# Altium schematic sheet 5G智慧网关工装1.SchDoc
size A3
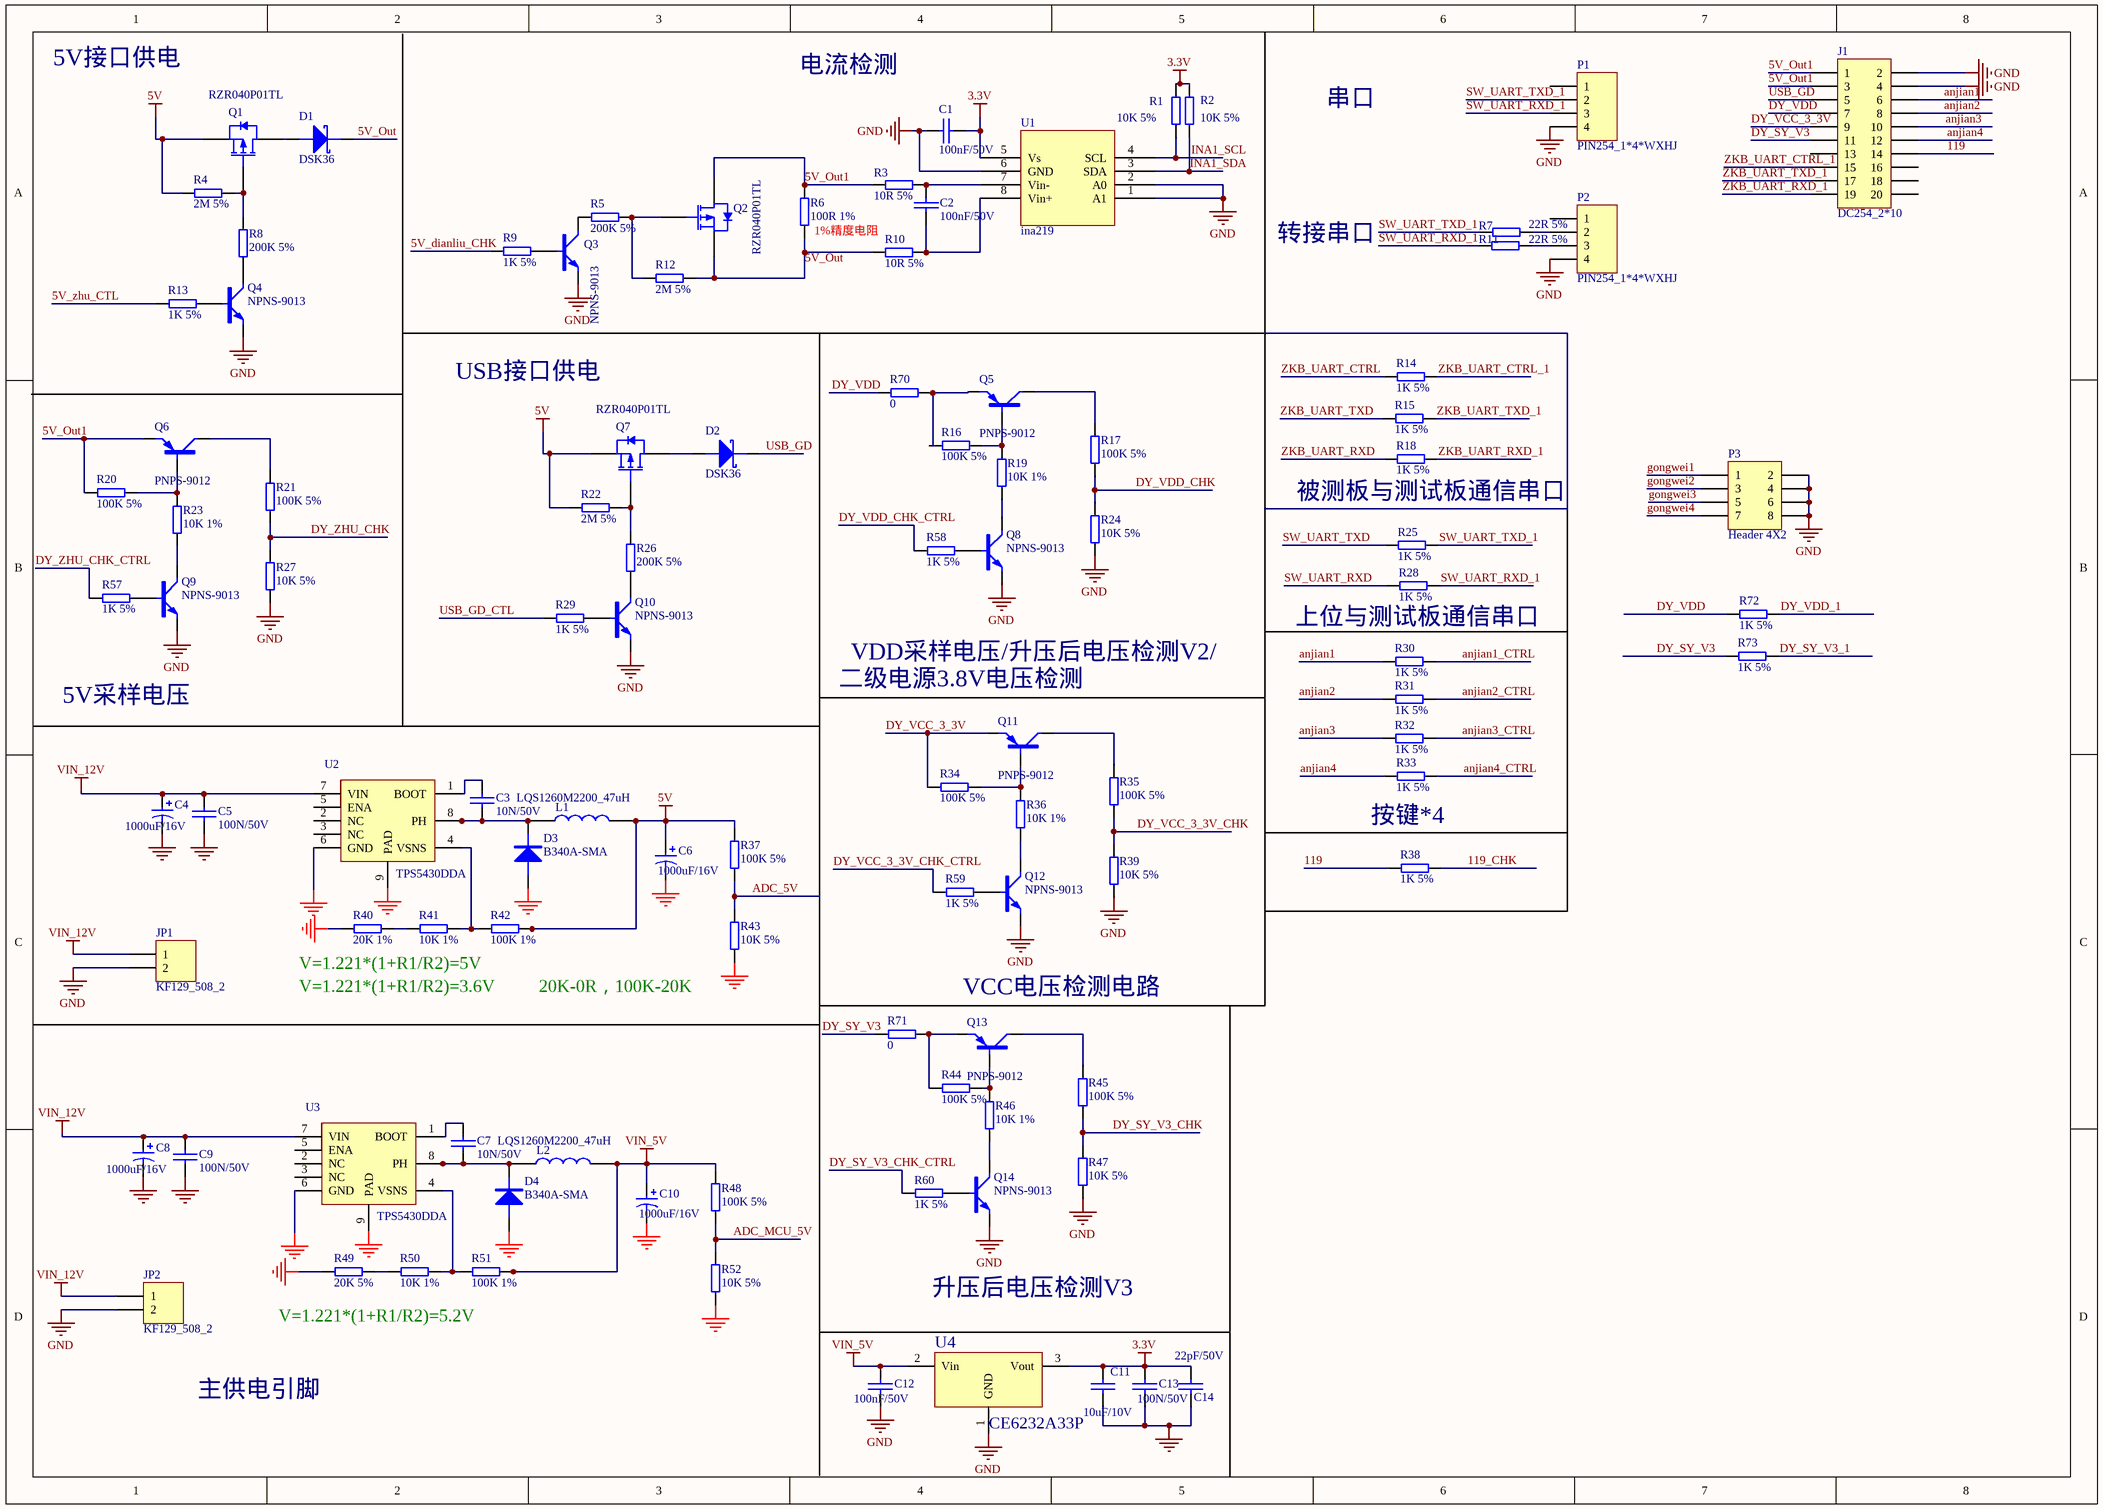
[diagram p0: 5G智慧网关工装1.SchDoc]

## Parts
C1  100nF/50V  [CAP0603]
C2  100nF/50V  [CAP0603]
C3  10N/50V  [CAP0603]
C4  1000uF/16V  [CAPPC_350_800_1600]
C5  100N/50V  [CAP0603]
C6  1000uF/16V  [CAPPC_350_800_1600]
C7  10N/50V  [CAP0603]
C8  1000uF/16V  [CAPPC_350_800_1600]
C9  100N/50V  [CAP0603]
C10  1000uF/16V  [CAPPC_350_800_1600]
C11  10uF/10V  [CAP0603]
C12  100nF/50V  [CAP0603]
C13  100N/50V  [CAP0603]
C14  22pF/50V  [CAP0603]
D1  DSK36  [SOD-123FL]
D2  DSK36  [SOD-123FL]
D3  B340A-SMA  [DO-214AC]
D4  B340A-SMA  [DO-214AC]
J1  DC254_2*10  [DC254_2*10]
JP1  KF129_508_2  [KF129_508_2]
JP2  KF129_508_2  [KF129_508_2]
L1  LQS1260M2200_47uH  [LQS1212]
L2  LQS1260M2200_47uH  [LQS1212]
P1  PIN254_1*4*WXHJ  [PIN254_1*4*1100S]
P2  PIN254_1*4*WXHJ  [PIN254_1*4*1100S]
P3  Header 4X2  [HDR2X4]
Q1  RZR040P01TL  [SOT-23]
Q2  RZR040P01TL  [SOT-23]
Q3  NPNS-9013  [SOT-23]
Q4  NPNS-9013  [SOT-23]
Q5  PNPS-9012  [SOT-23]
Q6  PNPS-9012  [SOT-23]
Q7  RZR040P01TL  [SOT-23]
Q8  NPNS-9013  [SOT-23]
Q9  NPNS-9013  [SOT-23]
Q10  NPNS-9013  [SOT-23]
Q11  PNPS-9012  [SOT-23]
Q12  NPNS-9013  [SOT-23]
Q13  PNPS-9012  [SOT-23]
Q14  NPNS-9013  [SOT-23]
R1  10K 5%  [RES0603]
R2  10K 5%  [RES0603]
R3  10R 5%  [RES0603]
R4  2M 5%  [RES0603]
R5  200K 5%  [RES0603]
R6  100R 1%  [RES0603]
R7  22R 5%  [RES0603]
R8  200K 5%  [RES0603]
R9  1K 5%  [RES0603]
R10  10R 5%  [RES0603]
R11  22R 5%  [RES0603]
R12  2M 5%  [RES0603]
R13  1K 5%  [RES0603]
R14  1K 5%  [RES0603]
R15  1K 5%  [RES0603]
R16  100K 5%  [RES0603]
R17  100K 5%  [RES0603]
R18  1K 5%  [RES0603]
R19  10K 1%  [RES0603]
R20  100K 5%  [RES0603]
R21  100K 5%  [RES0603]
R22  2M 5%  [RES0603]
R23  10K 1%  [RES0603]
R24  10K 5%  [RES0603]
R25  1K 5%  [RES0603]
R26  200K 5%  [RES0603]
R27  10K 5%  [RES0603]
R28  1K 5%  [RES0603]
R29  1K 5%  [RES0603]
R30  1K 5%  [RES0603]
R31  1K 5%  [RES0603]
R32  1K 5%  [RES0603]
R33  1K 5%  [RES0603]
R34  100K 5%  [RES0603]
R35  100K 5%  [RES0603]
R36  10K 1%  [RES0603]
R37  100K 5%  [RES0603]
R38  1K 5%  [RES0603]
R39  10K 5%  [RES0603]
R40  20K 1%  [RES0603]
R41  10K 1%  [RES0603]
R42  100K 1%  [RES0603]
R43  10K 5%  [RES0603]
R44  100K 5%  [RES0603]
R45  100K 5%  [RES0603]
R46  10K 1%  [RES0603]
R47  10K 5%  [RES0603]
R48  100K 5%  [RES0603]
R49  20K 5%  [RES0603]
R50  10K 1%  [RES0603]
R51  100K 1%  [RES0603]
R52  10K 5%  [RES0603]
R57  1K 5%  [RES0603]
R58  1K 5%  [RES0603]
R59  1K 5%  [RES0603]
R60  1K 5%  [RES0603]
R70  0  [RES0603]
R71  0  [RES0603]
R72  1K 5%  [RES0603]
R73  1K 5%  [RES0603]
U1  ina219  [SO-8]
U2  TPS5430DDA  [SOP-8-P]
U3  TPS5430DDA  [SOP-8-P]
U4  CE6232A33P  [SOT-89]

## Nets
3.3V: C1.2 C11.1 C13.1 C14.1 R1.1 R2.1 U1.5(Vs) U4.3(Vout)
5V: C6.1 L1.2 Q1.2(S) Q7.2(S) R4.1 R22.1 R37.2 R42.2
GND: C1.1 C4.2 C5.2 C6.2 C8.2 C9.2 C10.2 C11.2 C12.2 C13.2 C14.2 D3.1 D4.1 J1.2 J1.4 JP1.2 JP2.2 P1.4 P2.4 P3.2 P3.4 P3.6 P3.8 Q3.2(E) Q4.2(E) Q8.2(E) Q9.2(E) Q10.2(E) Q12.2(E) Q14.2(E) R24.2 R27.2 R39.2 R40.1 R43.1 R47.2 R49.1 R52.1 U1.1(A1) U1.2(A0) U1.6(GND) U2.6(GND) U2.9(PAD) U3.6(GND) U3.9(PAD) U4.1(GND)
VIN_5V: C10.1 C12.1 L2.2 R48.2 R51.2 U4.2(Vin)
VIN_12V: C4.1 C5.1 C8.1 C9.1 JP1.1 JP2.1 U2.7(VIN) U3.7(VIN)
5V_dianliu_CHK: R9.2
5V_Out: D1.2 Q2.2(S) R6.1 R10.1 R12.2
5V_Out1: J1.1 J1.3 Q2.3(D) Q6.2(E) R3.1 R6.2 R20.2
5V_zhu_CTL: R13.1
119: J1.14 R38.1
119_CHK: R38.2
ADC_5V: R37.1 R43.2
ADC_MCU_5V: R48.1 R52.2
anjian1: J1.6 R30.1
anjian1_CTRL: R30.2
anjian2: J1.8 R31.1
anjian2_CTRL: R31.2
anjian3: J1.10 R32.1
anjian3_CTRL: R32.2
anjian4: J1.12 R33.1
anjian4_CTRL: R33.2
DY_SY_V3: J1.11 R71.2 R73.1
DY_SY_V3_1: R73.2
DY_SY_V3_CHK: R45.2 R47.1
DY_SY_V3_CHK_CTRL: R60.1
DY_VCC_3_3V: J1.9 Q11.2(E) R34.2
DY_VCC_3_3V_CHK: R35.2 R39.1
DY_VCC_3_3V_CHK_CTRL: R59.1
DY_VDD: J1.7 R70.2 R72.1
DY_VDD_1: R72.2
DY_VDD_CHK: R17.2 R24.1
DY_VDD_CHK_CTRL: R58.1
DY_ZHU_CHK: R21.2 R27.1
DY_ZHU_CHK_CTRL: R57.1
gongwei1: P3.1
gongwei2: P3.3
gongwei3: P3.5
gongwei4: P3.7
INA1_SCL: R1.2 U1.4(SCL)
INA1_SDA: R2.2 U1.3(SDA)
SW_UART_RXD: R28.1
SW_UART_RXD_1: P1.3 R11.1 R28.2
SW_UART_TXD: R25.1
SW_UART_TXD_1: P1.2 R7.1 R25.2
USB_GD: D2.2 J1.5
USB_GD_CTL: R29.1
ZKB_UART_CTRL: R14.1
ZKB_UART_CTRL_1: J1.15 R14.2
ZKB_UART_RXD: R18.1
ZKB_UART_RXD_1: J1.19 R18.2
ZKB_UART_TXD: R15.1
ZKB_UART_TXD_1: J1.17 R15.2
NetC2_1: C2.1 R3.2 U1.7(Vin-)
NetC2_2: C2.2 R10.2 U1.8(Vin+)
NetC3_1: C3.1 D3.2 L1.1 U2.8(PH)
NetC3_2: C3.2 U2.1(BOOT)
NetC7_1: C7.1 D4.2 L2.1 U3.8(PH)
NetC7_2: C7.2 U3.1(BOOT)
NetD1_1: D1.1 Q1.3(D)
NetD2_1: D2.1 Q7.3(D)
NetP2_2: P2.2 R7.2
NetP2_3: P2.3 R11.2
NetQ1_1: Q1.1(G) R4.2 R8.2
NetQ2_1: Q2.1(G) R5.1 R12.1
NetQ3_1: Q3.1(B) R9.1
NetQ3_3: Q3.3(C) R5.2
NetQ4_1: Q4.1(B) R13.2
NetQ4_3: Q4.3(C) R8.1
NetQ5_1: Q5.1(B) R16.1 R19.1
NetQ5_2: Q5.2(E) R70.1
NetQ5_3: Q5.3(C) R17.1
NetQ6_1: Q6.1(B) R20.1 R23.1
NetQ6_3: Q6.3(C) R21.1
NetQ7_1: Q7.1(G) R22.2 R26.2
NetQ8_1: Q8.1(B) R58.2
NetQ8_3: Q8.3(C) R19.2
NetQ9_1: Q9.1(B) R57.2
NetQ9_3: Q9.3(C) R23.2
NetQ10_1: Q10.1(B) R29.2
NetQ10_3: Q10.3(C) R26.1
NetQ11_1: Q11.1(B) R34.1 R36.1
NetQ11_3: Q11.3(C) R35.1
NetQ12_1: Q12.1(B) R59.2
NetQ12_3: Q12.3(C) R36.2
NetQ13_1: Q13.1(B) R44.1 R46.1
NetQ13_2: Q13.2(E) R44.2 R71.1
NetQ13_3: Q13.3(C) R45.1
NetQ14_1: Q14.1(B) R60.2
NetQ14_3: Q14.3(C) R46.2
NetR40_2: R40.2 R41.1
NetR41_2: R41.2 R42.1 U2.4(VSNS)
NetR49_2: R49.2 R50.1
NetR50_2: R50.2 R51.1 U3.4(VSNS)

Not connected (* = marked no-connect by the designer): J1 13 16 18 20; P1 1; P2 1; R16 2; U2 2(NC) 3(NC) 5(ENA); U3 2(NC) 3(NC) 5(ENA)

## Notes on the sheet
- 5V接口供电
- 电流检测
- 串口
- (near R6) 1%精度电阻
- 转接串口
- USB接口供电
- (near R18) 被测板与测试板通信串口
- 上位与测试板通信串口
- 5V采样电压
- (near Q11) 二级电源3.8V电压检测
- VDD采样电压/升压后电压检测V2/
- 按键*4
- V=1.221*(1+R1/R2)=5V
- V=1.221*(1+R1/R2)=3.6V
- 20K-0R，100K-20K
- (near Q13) VCC电压检测电路
- V=1.221*(1+R1/R2)=5.2V
- 升压后电压检测V3
- 主供电引脚

## Library data of the parts
C1 C2 C12 = 101020103-0021: 104pF,50 V,±10%,0603,国巨,CC0603KRX7R9BB104; Part Name: 0603贴片电容; ID: 3; SMD/DIP: SMD; Part Number: 101020103-0021
C3 C7 = 101020103-0007: 10N/50V，±10%，0603; Part Name: 0603贴片电容; ID: 35; Part Number: 101020103-0007
C4 C6 C8 C10 = 1010203-0029: 1000uF,16 V,±20%,8*20mm,Rubycon,16ZLH1000M; Part Name: 电解电容; ID: 2; SMD/DIP: DIP; Part Number: 1010203-0029
C5 C9 C13 = 101020103-0021: 100N/50V，±10%，0603; Part Name: 0603贴片电容; ID: 34; Part Number: 101020103-0021
C11 = 101020103-0026: 106pF,10 V,±10%,0603,村田,GRM188R61A106KE47D; Part Name: 0603贴片电容; ID: 8; SMD/DIP: SMD; Part Number: 101020103-0026
C14 = 101020103-0009: 22pF,50 V,±5%,0603,国巨,CC0603JRNPO9BN22; Part Name: 0603贴片电容; ID: 16; SMD/DIP: SMD; Part Number: 101020103-0009
D1 D2 = 101040101-0043: DSK14,SOD-123FL,1 A,40 V,28 V,台湾强茂集团苏州群鑫电子,DSK14; Part Name: 二极管; ID: 10; SMD/DIP: SMD; Part Number: 101040101-0043
D3 D4 = 101040101-0014: Part Name: 贴片肖特基; ID: 24; Part Number: 101040101-0014
J1 = 1010902-0139: DC2 2.54mm 2x10pin,2.54mm间距，2x10pin，32×8.55×27.5mm,母头,双排,双排牛角座; Part Name: DC牛角座; ID: 4; SMD/DIP: DIP; Part Number: 1010902-0139
JP1 JP2 = 1010904-0015: KF129-2P,螺丝紧固,2,ABS,松涛; Part Name: 接线端子; ID: 7; SMD/DIP: DIP; Part Number: 1010904-0015
L1 L2 = 1010302-0007: 47uH/2.2A,±20%，0.072Ω，L1200X1200X600; Part Name: 贴片电感; ID: 3; Part Number: 1010302-0007
P1 P2 = AD_WXHJ_PinHeader_01: 1*4 ，Φ1.0 ，2.54mm，直脚,无需焊接器件; Part Name: 排针; ID: 16; SMD/DIP: DIP; Part Number: AD_WXHJ_PinHeader_01
P3 = Header 4X2: Header, 4-Pin, Dual row
Q1 Q2 Q7 = 101040201-0010: RZR040P01TL；1.5v导通,P-MOS,SOT-23,罗姆,RZR040P01TL; Part Name: PMOS管; ID: 18; SMD/DIP: SMD; Part Number: 101040201-0010
Q3 Q4 Q8-Q10 Q12 Q14 = 101040201-0002: 9013,NPN,SOT-23,长电,S9013; Part Name: 贴片三极管; ID: 15; SMD/DIP: SMD; Part Number: 101040201-0002
Q5 Q6 Q11 Q13 = 101040201-0001: 9012,PNP,SOT-23,JCET;长电,S9012; Part Name: 贴片三极管; ID: 17; SMD/DIP: SMD; Part Number: 101040201-0001
R1 R2 R24 R27 R39 R47 = 101010103-0003: 国巨,±5%,0603,,155 ℃,-55 ℃,RC0603JR-0710KL,无铅,200 ppm/℃,1/10W,,10K; Part Name: 0603贴片电阻; ID: 7; SMD/DIP: SMD; Part Number: 101010103-0003
R3 R10 = 101010103-0017: 10R,±5%,1/10W,0603,国巨,RC0603JR-0710RL; Part Name: 0603贴片电阻; ID: 8; SMD/DIP: SMD; Part Number: 101010103-0017
R4 R12 R22 = 101010103-0025: 国巨,±5%,0603,,155 ℃,-55 ℃,RC0603JR-072ML,含铅,100 ppm/℃,1/10W,,2M; Part Name: 0603贴片电阻; ID: 20; SMD/DIP: SMD; Part Number: 101010103-0025
R5 R8 R26 = 101010103-0034: 200K,±5%,1/10W,0603,国巨,RC0603JR-07200KL; Part Name: 0603贴片电阻; ID: 13; SMD/DIP: SMD; Part Number: 101010103-0034
R6 = 101010103-0041: 100Ω,±1%,1/10W,0603,国巨股份有限公司,RC0603FR-07100RL; Part Name: 0603贴片电阻; ID: 4; SMD/DIP: SMD; Part Number: 101010103-0041
R7 R11 = 101010103-0009: 国巨,±5%,0603,,155 ℃,-55 ℃,RC0603JR-0722RL,无铅,200 ppm/℃,1/10W,,22欧; Part Name: 0603贴片电阻; ID: 18; SMD/DIP: SMD; Part Number: 101010103-0009
R9 R13-R15 R18 R25 R28-R33 R38 R57-R60 R72 R73 = 101010103-0008: 1K,±5%,1/10W,0603,国巨,RC0603JR-071KL; Part Name: 0603贴片电阻; ID: 10; SMD/DIP: SMD; Part Number: 101010103-0008
R16 R17 R20 R21 R34 R35 R44 R45 R70 R71 = 101010103-0005: 国巨,±5%,0603,,155 ℃,-55 ℃,RC0603JR-07100KL,无铅,100 ppm/℃,1/10W,,100K; Part Name: 0603贴片电阻; ID: 3; SMD/DIP: SMD; Part Number: 101010103-0005
R19 R23 R36 R46 = 101010103-0052: 10K±1%,1/10W,0603; Part Name: 0603贴片电阻; ID: 6; SMD/DIP: SMD; Part Number: 101010103-0052
R37 R43 R48 R52 = 101010103-0005: 100K±5%,1/10W,0603; Part Name: 0603贴片电阻; ID: 30; Part Number: 101010103-0005
R40 = 101010103-0048: 20K,±1%,1/10W,0603,国巨,RC0603FR-0720KL; Part Name: 0603贴片电阻; ID: 14; SMD/DIP: SMD; Part Number: 101010103-0048
R41 R50 = 101010103-0053: 8.2k±1%,1/10W,0603; Part Name: 0603贴片电阻; ID: 142; Part Number: 101010103-0053
R42 R51 = 101010103-0048: 20K±1%,1/10W,0603; Part Name: 0603贴片电阻; ID: 139; Part Number: 101010103-0048
R49 = 101010103-0004: 国巨,±5%,0603,,155 ℃,-55 ℃,RC0603JR-0720KL,无铅,200 ppm/℃,1/10W,,20K; Part Name: 0603贴片电阻; ID: 15; SMD/DIP: SMD; Part Number: 101010103-0004
U1 = Component_2
U2 U3 = 101050101-0053: TPS5430DDA,SOP8,TI,TPS5430DDA; Part Name: 电源芯片; ID: 9; SMD/DIP: SMD; Part Number: 101050101-0053
U4 = 1010503-0029: CE6232-3.3,CE6232-3.3,SOT89-3,8V,1.8V,0.11V,3.3V,300mA,0.8uA,南京芯力微电子有限公司; Part Name: 线性稳压芯片; ID: 5; SMD/DIP: SMD; Part Number: 1010503-0029